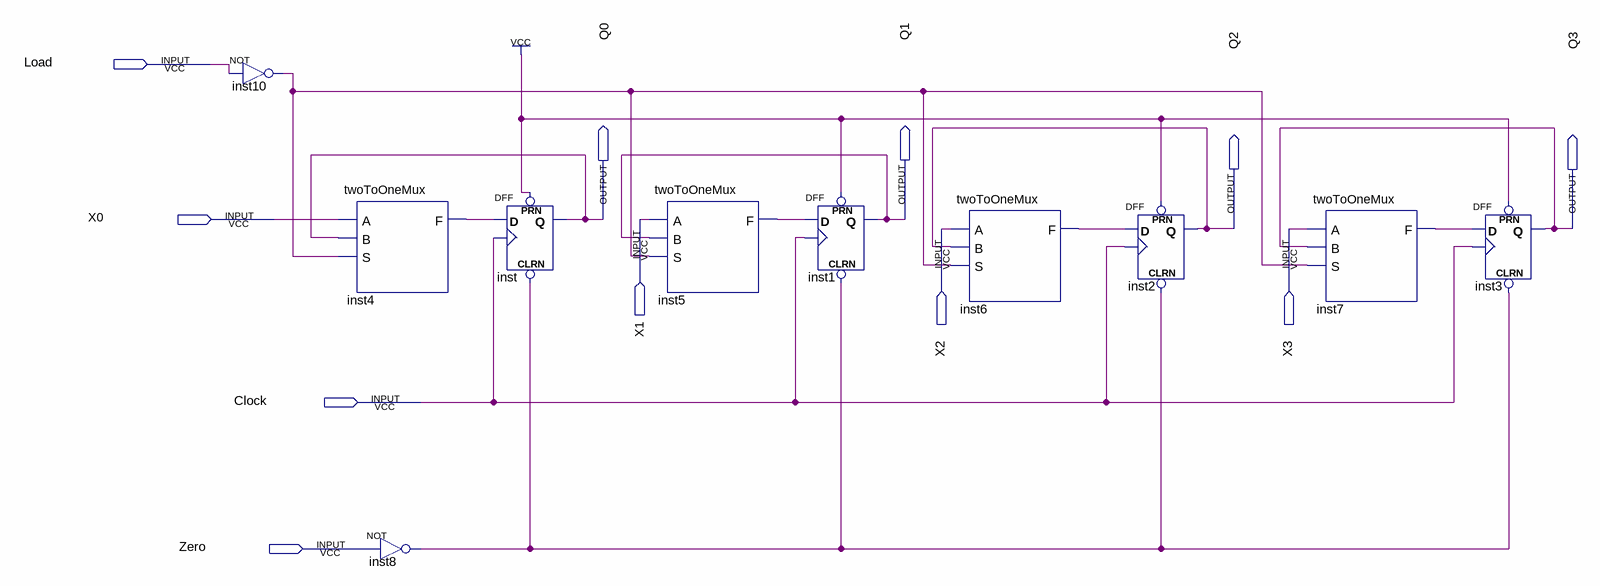
[diagram p0: schematic sheet]
// Quartus schematic final_Project_register.bdf as structural Verilog: 10 symbols, 11 pins
module final_Project_register (
  input  Load,
  input  X0,
  input  X1,
  input  X2,
  input  X3,
  input  Clock,
  input  Zero,
  output Q0,
  output Q1,
  output Q2,
  output Q3
);

  wire inst4_f, inst5_f, inst6_f, inst7_f, inst8_out, inst10_out;

  not inst10 (inst10_out, Load);
  twoToOneMux inst4 (.A(X0), .B(Q0), .S(inst10_out), .F(inst4_f));
  not inst8 (inst8_out, Zero);
  DFF inst (.CLRN(inst8_out), .CLK(Clock), .D(inst4_f), .PRN(1'b1), .Q(Q0));
  twoToOneMux inst5 (.A(X1), .B(Q1), .S(inst10_out), .F(inst5_f));
  DFF inst1 (.CLRN(inst8_out), .CLK(Clock), .D(inst5_f), .PRN(1'b1), .Q(Q1));
  twoToOneMux inst6 (.A(X2), .B(Q2), .S(inst10_out), .F(inst6_f));
  DFF inst2 (.CLRN(inst8_out), .CLK(Clock), .D(inst6_f), .PRN(1'b1), .Q(Q2));
  twoToOneMux inst7 (.A(X3), .B(Q3), .S(inst10_out), .F(inst7_f));
  DFF inst3 (.CLRN(inst8_out), .CLK(Clock), .D(inst7_f), .PRN(1'b1), .Q(Q3));
endmodule
